# Altium schematic sheet RGB_LEDs.SchDoc
size A
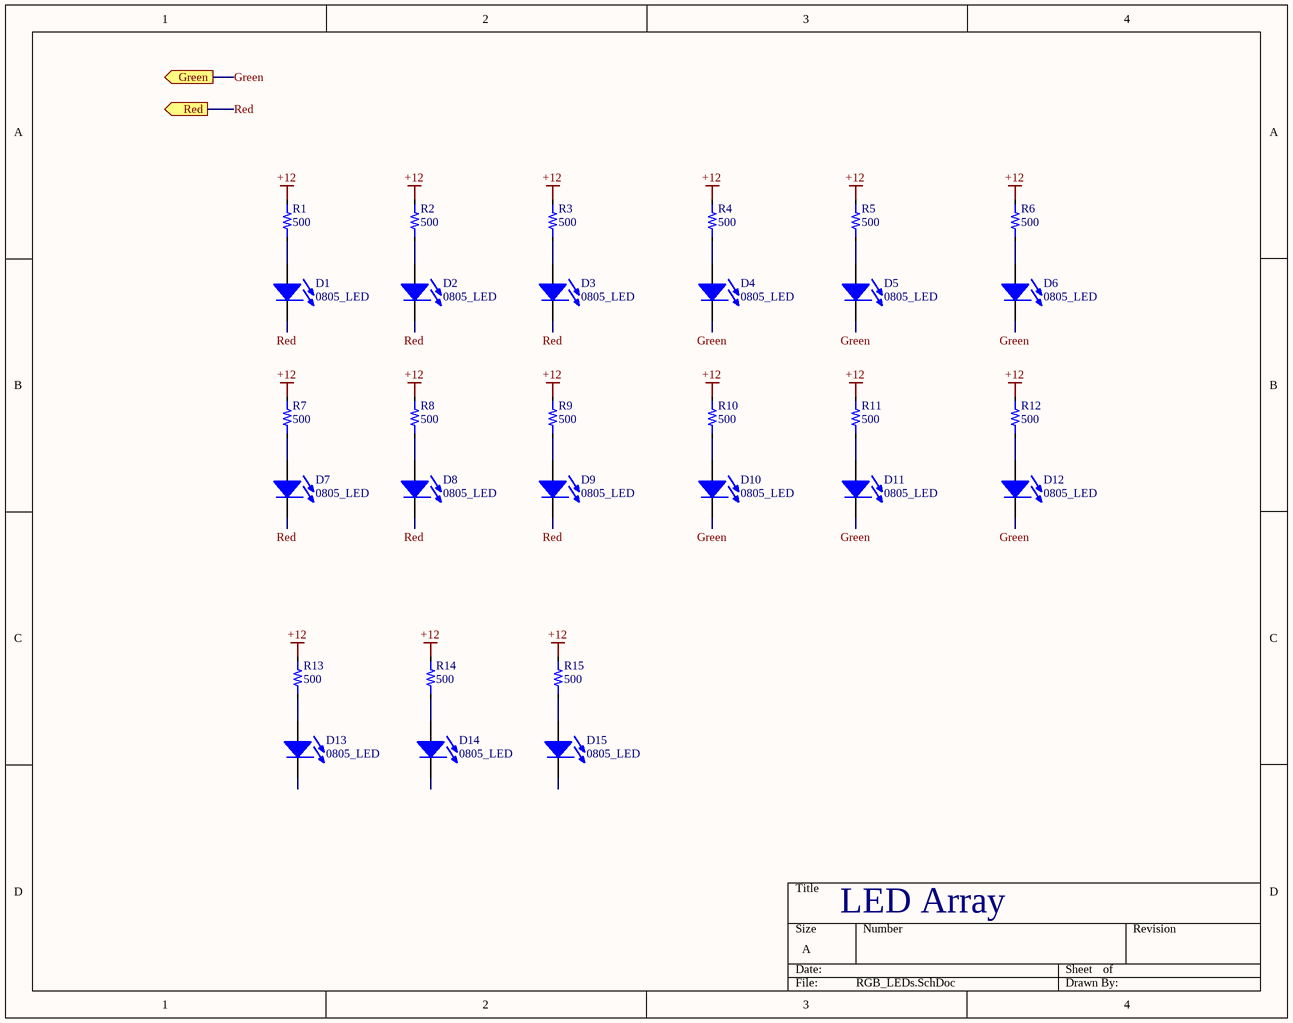
[diagram p0: RGB_LEDs.SchDoc]

## Parts
D1  0805_LED  [0805_LED]
D2  0805_LED  [0805_LED]
D3  0805_LED  [0805_LED]
D4  0805_LED  [0805_LED]
D5  0805_LED  [0805_LED]
D6  0805_LED  [0805_LED]
D7  0805_LED  [0805_LED]
D8  0805_LED  [0805_LED]
D9  0805_LED  [0805_LED]
D10  0805_LED  [0805_LED]
D11  0805_LED  [0805_LED]
D12  0805_LED  [0805_LED]
D13  0805_LED  [0805_LED]
D14  0805_LED  [0805_LED]
D15  0805_LED  [0805_LED]
R1  value 500  [0603_RES]  (hidden comment: Resistor)
R2  value 500  [0603_RES]  (hidden comment: Resistor)
R3  value 500  [0603_RES]  (hidden comment: Resistor)
R4  value 500  [0603_RES]  (hidden comment: Resistor)
R5  value 500  [0603_RES]  (hidden comment: Resistor)
R6  value 500  [0603_RES]  (hidden comment: Resistor)
R7  value 500  [0603_RES]  (hidden comment: Resistor)
R8  value 500  [0603_RES]  (hidden comment: Resistor)
R9  value 500  [0603_RES]  (hidden comment: Resistor)
R10  value 500  [0603_RES]  (hidden comment: Resistor)
R11  value 500  [0603_RES]  (hidden comment: Resistor)
R12  value 500  [0603_RES]  (hidden comment: Resistor)
R13  value 500  [0603_RES]  (hidden comment: Resistor)
R14  value 500  [0603_RES]  (hidden comment: Resistor)
R15  value 500  [0603_RES]  (hidden comment: Resistor)

## Ports
Green (out), Red (out)

## Nets
+12: R1.2 R2.2 R3.2 R4.2 R5.2 R6.2 R7.2 R8.2 R9.2 R10.2 R11.2 R12.2 R13.2 R14.2 R15.2
Green: D4.2(K) D5.2(K) D6.2(K) D10.2(K) D11.2(K) D12.2(K) ; port Green
Red: D1.2(K) D2.2(K) D3.2(K) D7.2(K) D8.2(K) D9.2(K) ; port Red
NetD1_1: D1.1(A) R1.1
NetD2_1: D2.1(A) R2.1
NetD3_1: D3.1(A) R3.1
NetD4_1: D4.1(A) R4.1
NetD5_1: D5.1(A) R5.1
NetD6_1: D6.1(A) R6.1
NetD7_1: D7.1(A) R7.1
NetD8_1: D8.1(A) R8.1
NetD9_1: D9.1(A) R9.1
NetD10_1: D10.1(A) R10.1
NetD11_1: D11.1(A) R11.1
NetD12_1: D12.1(A) R12.1
NetD13_1: D13.1(A) R13.1
NetD14_1: D14.1(A) R14.1
NetD15_1: D15.1(A) R15.1

Not connected (* = marked no-connect by the designer): D13 2(K); D14 2(K); D15 2(K)

## Notes on the sheet
- LED Array

## Library data of the parts
D1-D15 = 0805_LED: Generic 0805 LED
R1-R15 = Resistor: Tolerance: *